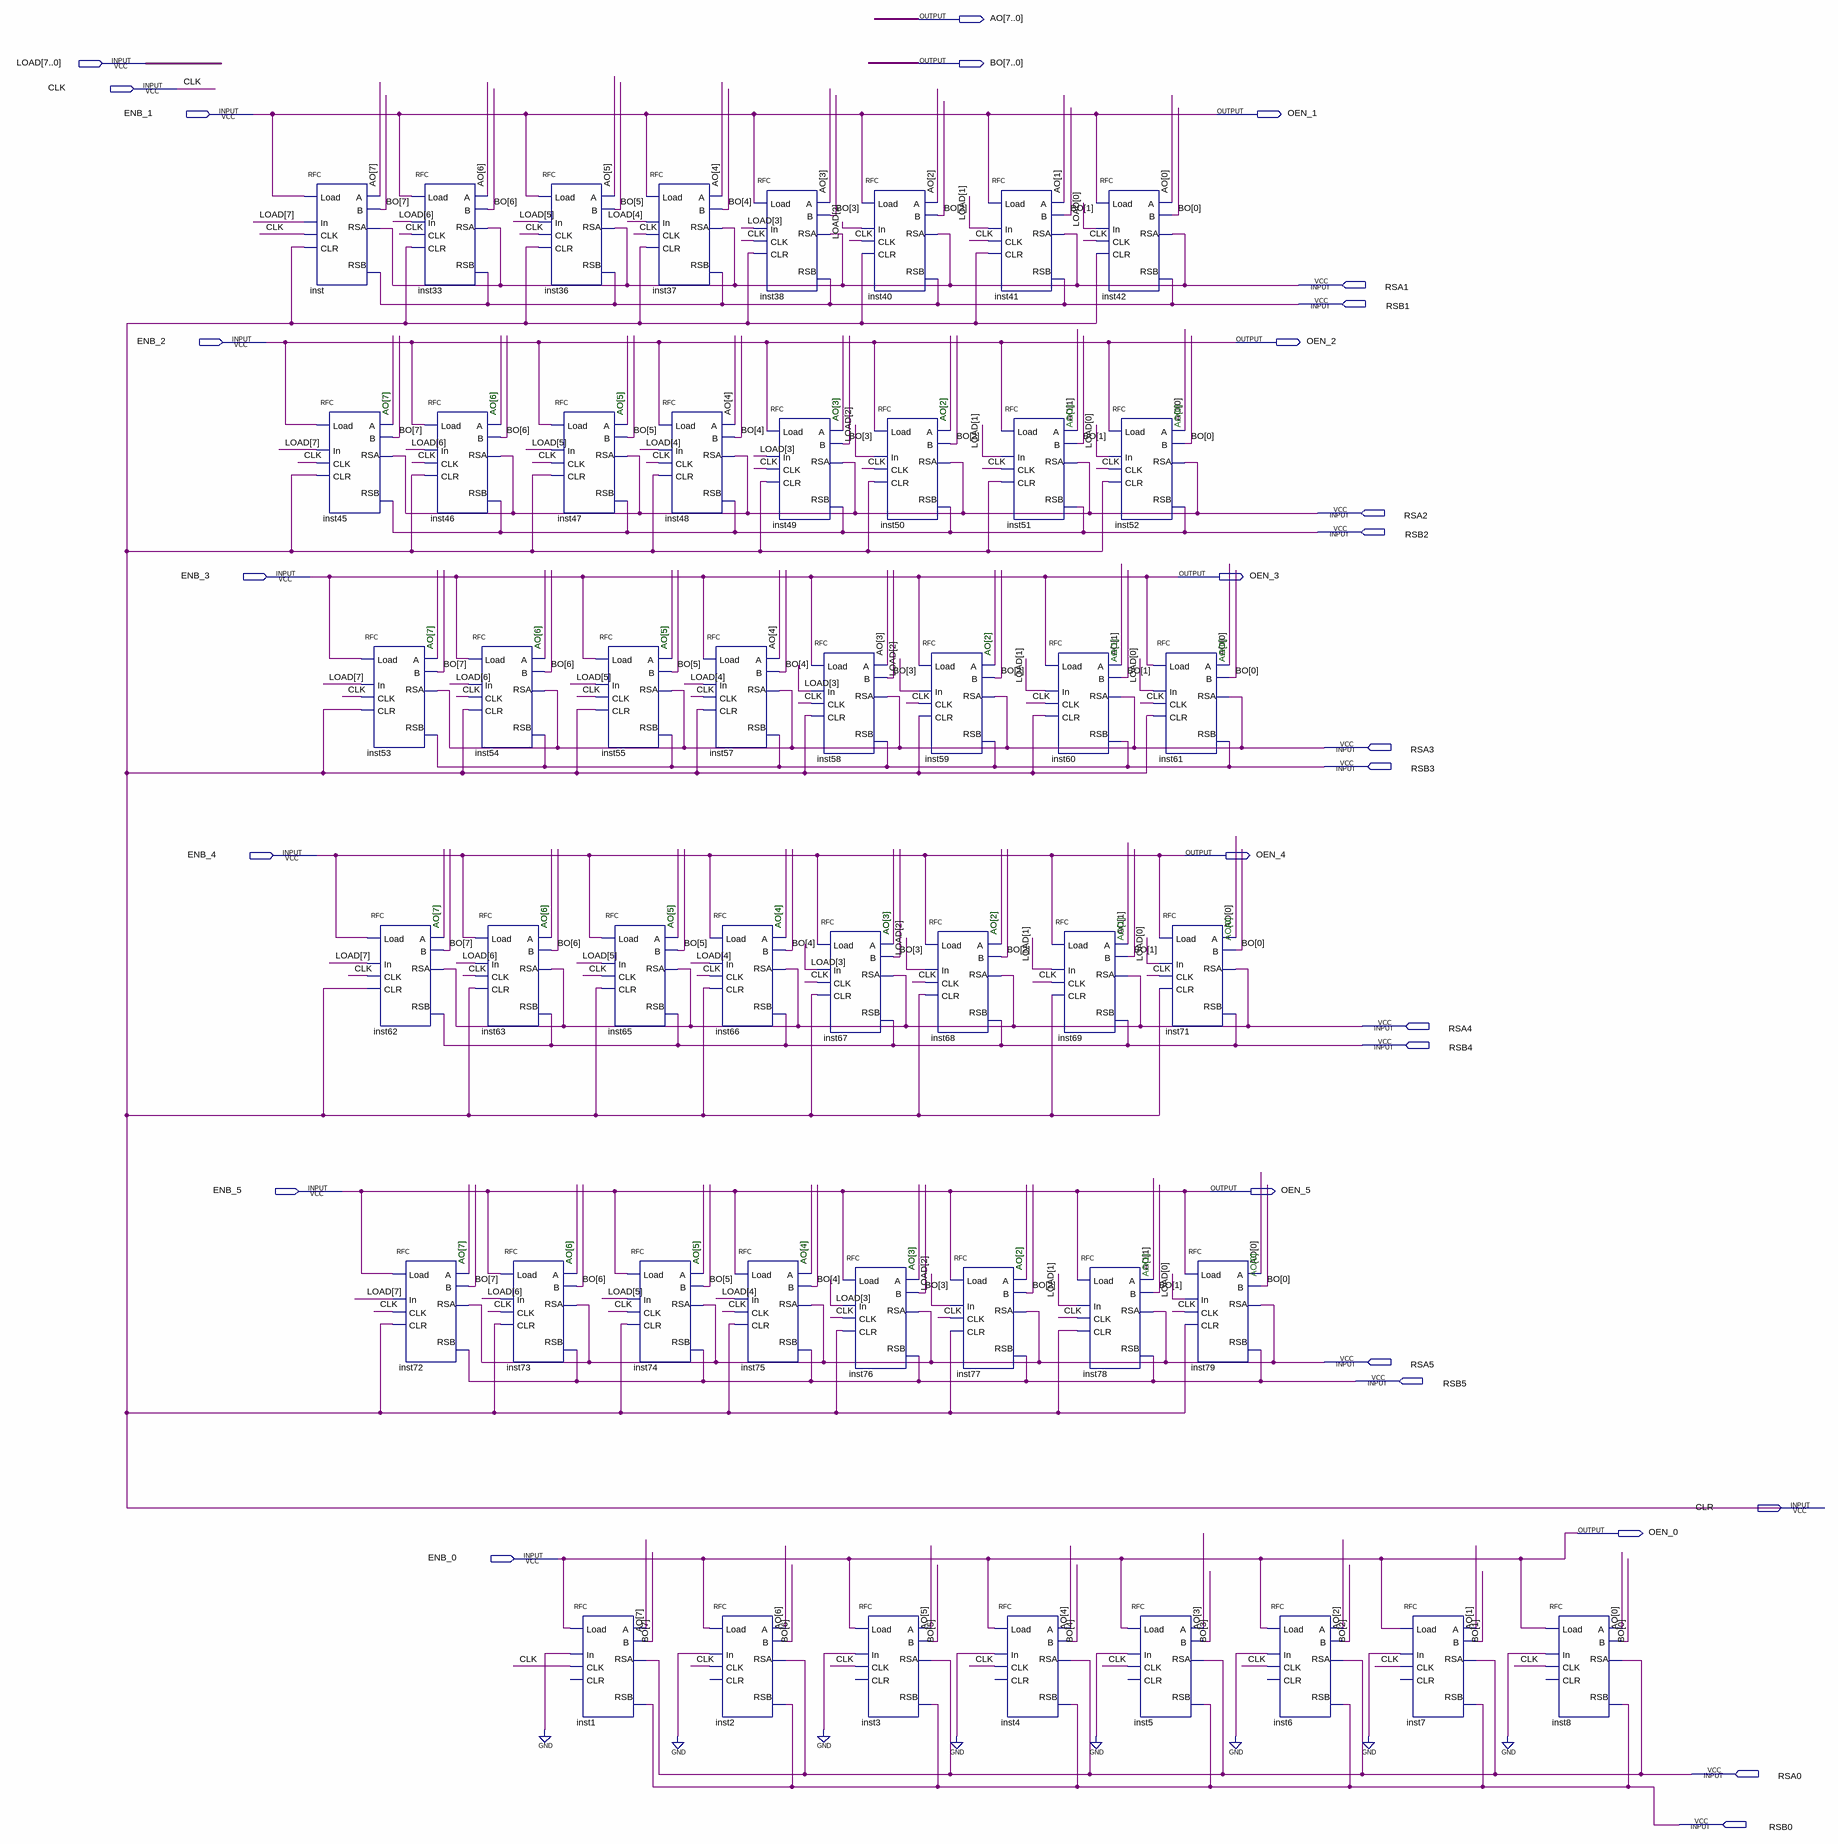
[diagram p0: schematic sheet]
// Quartus schematic RFILE_8BITS.bdf as structural Verilog: 48 symbols, 29 pins
module RFILE_8BITS (
  input  [7:0] LOAD,
  input  CLK,
  input  ENB_1,
  input  RSA1,
  input  RSB1,
  input  ENB_2,
  input  RSA2,
  input  RSB2,
  input  ENB_3,
  input  RSA3,
  input  RSB3,
  input  ENB_4,
  input  RSA4,
  input  RSB4,
  input  ENB_5,
  input  RSA5,
  input  RSB5,
  input  CLR,
  input  ENB_0,
  input  RSA0,
  input  RSB0,
  output [7:0] AO,
  output [7:0] BO,
  output OEN_1,
  output OEN_2,
  output OEN_3,
  output OEN_4,
  output OEN_5,
  output OEN_0
);

  RFC inst (.Load(ENB_1), .RSA(RSA1), .In(LOAD[7]), .CLK(CLK), .CLR(CLR), .RSB(RSB1), .A(AO[7]), .B(BO[7]));
  RFC inst45 (.Load(ENB_2), .RSA(RSA2), .In(LOAD[7]), .CLK(CLK), .CLR(CLR), .RSB(RSB2), .A(AO[7]), .B(BO[7]));
  RFC inst53 (.Load(ENB_3), .RSA(RSA3), .In(LOAD[7]), .CLK(CLK), .CLR(CLR), .RSB(RSB3), .A(AO[7]), .B(BO[7]));
  RFC inst62 (.Load(ENB_4), .RSA(RSA4), .In(LOAD[7]), .CLK(CLK), .CLR(CLR), .RSB(RSB4), .A(AO[7]), .B(BO[7]));
  RFC inst72 (.Load(ENB_5), .RSA(RSA5), .In(LOAD[7]), .CLK(CLK), .CLR(CLR), .RSB(RSB5), .A(AO[7]), .B(BO[7]));
  RFC inst33 (.Load(ENB_1), .RSA(RSA1), .In(LOAD[6]), .CLK(CLK), .CLR(CLR), .RSB(RSB1), .A(AO[6]), .B(BO[6]));
  RFC inst46 (.Load(ENB_2), .RSA(RSA2), .In(LOAD[6]), .CLK(CLK), .CLR(CLR), .RSB(RSB2), .A(AO[6]), .B(BO[6]));
  RFC inst54 (.Load(ENB_3), .RSA(RSA3), .In(LOAD[6]), .CLK(CLK), .CLR(CLR), .RSB(RSB3), .A(AO[6]), .B(BO[6]));
  RFC inst63 (.Load(ENB_4), .RSA(RSA4), .In(LOAD[6]), .CLK(CLK), .CLR(CLR), .RSB(RSB4), .A(AO[6]), .B(BO[6]));
  RFC inst36 (.Load(ENB_1), .RSA(RSA1), .In(LOAD[5]), .CLK(CLK), .CLR(CLR), .RSB(RSB1), .A(AO[5]), .B(BO[5]));
  RFC inst73 (.Load(ENB_5), .RSA(RSA5), .In(LOAD[6]), .CLK(CLK), .CLR(CLR), .RSB(RSB5), .A(AO[6]), .B(BO[6]));
  RFC inst47 (.Load(ENB_2), .RSA(RSA2), .In(LOAD[5]), .CLK(CLK), .CLR(CLR), .RSB(RSB2), .A(AO[5]), .B(BO[5]));
  RFC inst55 (.Load(ENB_3), .RSA(RSA3), .In(LOAD[5]), .CLK(CLK), .CLR(CLR), .RSB(RSB3), .A(AO[5]), .B(BO[5]));
  RFC inst1 (.Load(ENB_0), .RSA(RSA0), .In(1'b0), .CLK(CLK), .RSB(RSB0), .A(AO[7]), .B(BO[7]));  // open: CLR
  RFC inst37 (.Load(ENB_1), .RSA(RSA1), .In(LOAD[4]), .CLK(CLK), .CLR(CLR), .RSB(RSB1), .A(AO[4]), .B(BO[4]));
  RFC inst65 (.Load(ENB_4), .RSA(RSA4), .In(LOAD[5]), .CLK(CLK), .CLR(CLR), .RSB(RSB4), .A(AO[5]), .B(BO[5]));
  RFC inst74 (.Load(ENB_5), .RSA(RSA5), .In(LOAD[5]), .CLK(CLK), .CLR(CLR), .RSB(RSB5), .A(AO[5]), .B(BO[5]));
  RFC inst48 (.Load(ENB_2), .RSA(RSA2), .In(LOAD[4]), .CLK(CLK), .CLR(CLR), .RSB(RSB2), .A(AO[4]), .B(BO[4]));
  RFC inst57 (.Load(ENB_3), .RSA(RSA3), .In(LOAD[4]), .CLK(CLK), .CLR(CLR), .RSB(RSB3), .A(AO[4]), .B(BO[4]));
  RFC inst66 (.Load(ENB_4), .RSA(RSA4), .In(LOAD[4]), .CLK(CLK), .CLR(CLR), .RSB(RSB4), .A(AO[4]), .B(BO[4]));
  RFC inst75 (.Load(ENB_5), .RSA(RSA5), .In(LOAD[4]), .CLK(CLK), .CLR(CLR), .RSB(RSB5), .A(AO[4]), .B(BO[4]));
  RFC inst2 (.Load(ENB_0), .RSA(RSA0), .In(1'b0), .CLK(CLK), .RSB(RSB0), .A(AO[6]), .B(BO[6]));  // open: CLR
  RFC inst38 (.Load(ENB_1), .RSA(RSA1), .In(LOAD[3]), .CLK(CLK), .CLR(CLR), .RSB(RSB1), .A(AO[3]), .B(BO[3]));
  RFC inst49 (.Load(ENB_2), .RSA(RSA2), .In(LOAD[3]), .CLK(CLK), .CLR(CLR), .RSB(RSB2), .A(AO[3]), .B(BO[3]));
  RFC inst58 (.Load(ENB_3), .RSA(RSA3), .In(LOAD[3]), .CLK(CLK), .CLR(CLR), .RSB(RSB3), .A(AO[3]), .B(BO[3]));
  RFC inst67 (.Load(ENB_4), .RSA(RSA4), .In(LOAD[3]), .CLK(CLK), .CLR(CLR), .RSB(RSB4), .A(AO[3]), .B(BO[3]));
  RFC inst76 (.Load(ENB_5), .RSA(RSA5), .In(LOAD[3]), .CLK(CLK), .CLR(CLR), .RSB(RSB5), .A(AO[3]), .B(BO[3]));
  RFC inst40 (.Load(ENB_1), .RSA(RSA1), .In(LOAD[2]), .CLK(CLK), .CLR(CLR), .RSB(RSB1), .A(AO[2]), .B(BO[2]));
  RFC inst50 (.Load(ENB_2), .RSA(RSA2), .In(LOAD[2]), .CLK(CLK), .CLR(CLR), .RSB(RSB2), .A(AO[2]), .B(BO[2]));
  RFC inst3 (.Load(ENB_0), .RSA(RSA0), .In(1'b0), .CLK(CLK), .RSB(RSB0), .A(AO[5]), .B(BO[5]));  // open: CLR
  RFC inst59 (.Load(ENB_3), .RSA(RSA3), .In(LOAD[2]), .CLK(CLK), .CLR(CLR), .RSB(RSB3), .A(AO[2]), .B(BO[2]));
  RFC inst68 (.Load(ENB_4), .RSA(RSA4), .In(LOAD[2]), .CLK(CLK), .CLR(CLR), .RSB(RSB4), .A(AO[2]), .B(BO[2]));
  RFC inst77 (.Load(ENB_5), .RSA(RSA5), .In(LOAD[2]), .CLK(CLK), .CLR(CLR), .RSB(RSB5), .A(AO[2]), .B(BO[2]));
  RFC inst41 (.Load(ENB_1), .RSA(RSA1), .In(LOAD[1]), .CLK(CLK), .CLR(CLR), .RSB(RSB1), .A(AO[1]), .B(BO[1]));
  RFC inst51 (.Load(ENB_2), .RSA(RSA2), .In(LOAD[1]), .CLK(CLK), .CLR(CLR), .RSB(RSB2), .A(AO[1]), .B(BO[1]));
  RFC inst4 (.Load(ENB_0), .RSA(RSA0), .In(1'b0), .CLK(CLK), .RSB(RSB0), .A(AO[4]), .B(BO[4]));  // open: CLR
  RFC inst60 (.Load(ENB_3), .RSA(RSA3), .In(LOAD[1]), .CLK(CLK), .CLR(CLR), .RSB(RSB3), .A(AO[1]), .B(BO[1]));
  RFC inst69 (.Load(ENB_4), .RSA(RSA4), .In(LOAD[1]), .CLK(CLK), .CLR(CLR), .RSB(RSB4), .A(AO[1]), .B(BO[1]));
  RFC inst42 (.Load(ENB_1), .RSA(RSA1), .In(LOAD[0]), .CLK(CLK), .CLR(CLR), .RSB(RSB1), .A(AO[0]), .B(BO[0]));
  RFC inst78 (.Load(ENB_5), .RSA(RSA5), .In(LOAD[1]), .CLK(CLK), .CLR(CLR), .RSB(RSB5), .A(AO[1]), .B(BO[1]));
  RFC inst52 (.Load(ENB_2), .RSA(RSA2), .In(LOAD[0]), .CLK(CLK), .CLR(CLR), .RSB(RSB2), .A(AO[0]), .B(BO[0]));
  RFC inst61 (.Load(ENB_3), .RSA(RSA3), .In(LOAD[0]), .CLK(CLK), .CLR(CLR), .RSB(RSB3), .A(AO[0]), .B(BO[0]));
  RFC inst5 (.Load(ENB_0), .RSA(RSA0), .In(1'b0), .CLK(CLK), .RSB(RSB0), .A(AO[3]), .B(BO[3]));  // open: CLR
  RFC inst71 (.Load(ENB_4), .RSA(RSA4), .In(LOAD[0]), .CLK(CLK), .CLR(CLR), .RSB(RSB4), .A(AO[0]), .B(BO[0]));
  RFC inst79 (.Load(ENB_5), .RSA(RSA5), .In(LOAD[0]), .CLK(CLK), .CLR(CLR), .RSB(RSB5), .A(AO[0]), .B(BO[0]));
  RFC inst6 (.Load(ENB_0), .RSA(RSA0), .In(1'b0), .CLK(CLK), .RSB(RSB0), .A(AO[2]), .B(BO[2]));  // open: CLR
  RFC inst7 (.Load(ENB_0), .RSA(RSA0), .In(1'b0), .CLK(CLK), .RSB(RSB0), .A(AO[1]), .B(BO[1]));  // open: CLR
  RFC inst8 (.Load(ENB_0), .RSA(RSA0), .In(1'b0), .CLK(CLK), .RSB(RSB0), .A(AO[0]), .B(BO[0]));  // open: CLR

  assign OEN_0 = ENB_0;
  assign OEN_1 = ENB_1;
  assign OEN_2 = ENB_2;
  assign OEN_3 = ENB_3;
  assign OEN_4 = ENB_4;
  assign OEN_5 = ENB_5;

  // Notes on the sheet:
  //   AO[7]
  //   AO[6]
  //   AO[5]
  //   AO[3]
  //   AO[2]
  //   AO[1]
  //   AO[0]
  //   AO[7]
  //   AO[6]
  //   AO[5]
  //   AO[2]
  //   AO[1]
  //   AO[0]
  //   AO[7]
  //   AO[6]
  //   AO[5]
  //   AO[4]
  //   AO[3]
  //   AO[2]
  //   AO[1]
  //   AO[0]
  //   AO[7]
  //   AO[6]
  //   AO[5]
  //   AO[4]
  //   AO[3]
  //   AO[2]
  //   AO[1]
  //   AO[0]
endmodule
